# EAGLE design linearSensor (EAGLE 7.3.0)
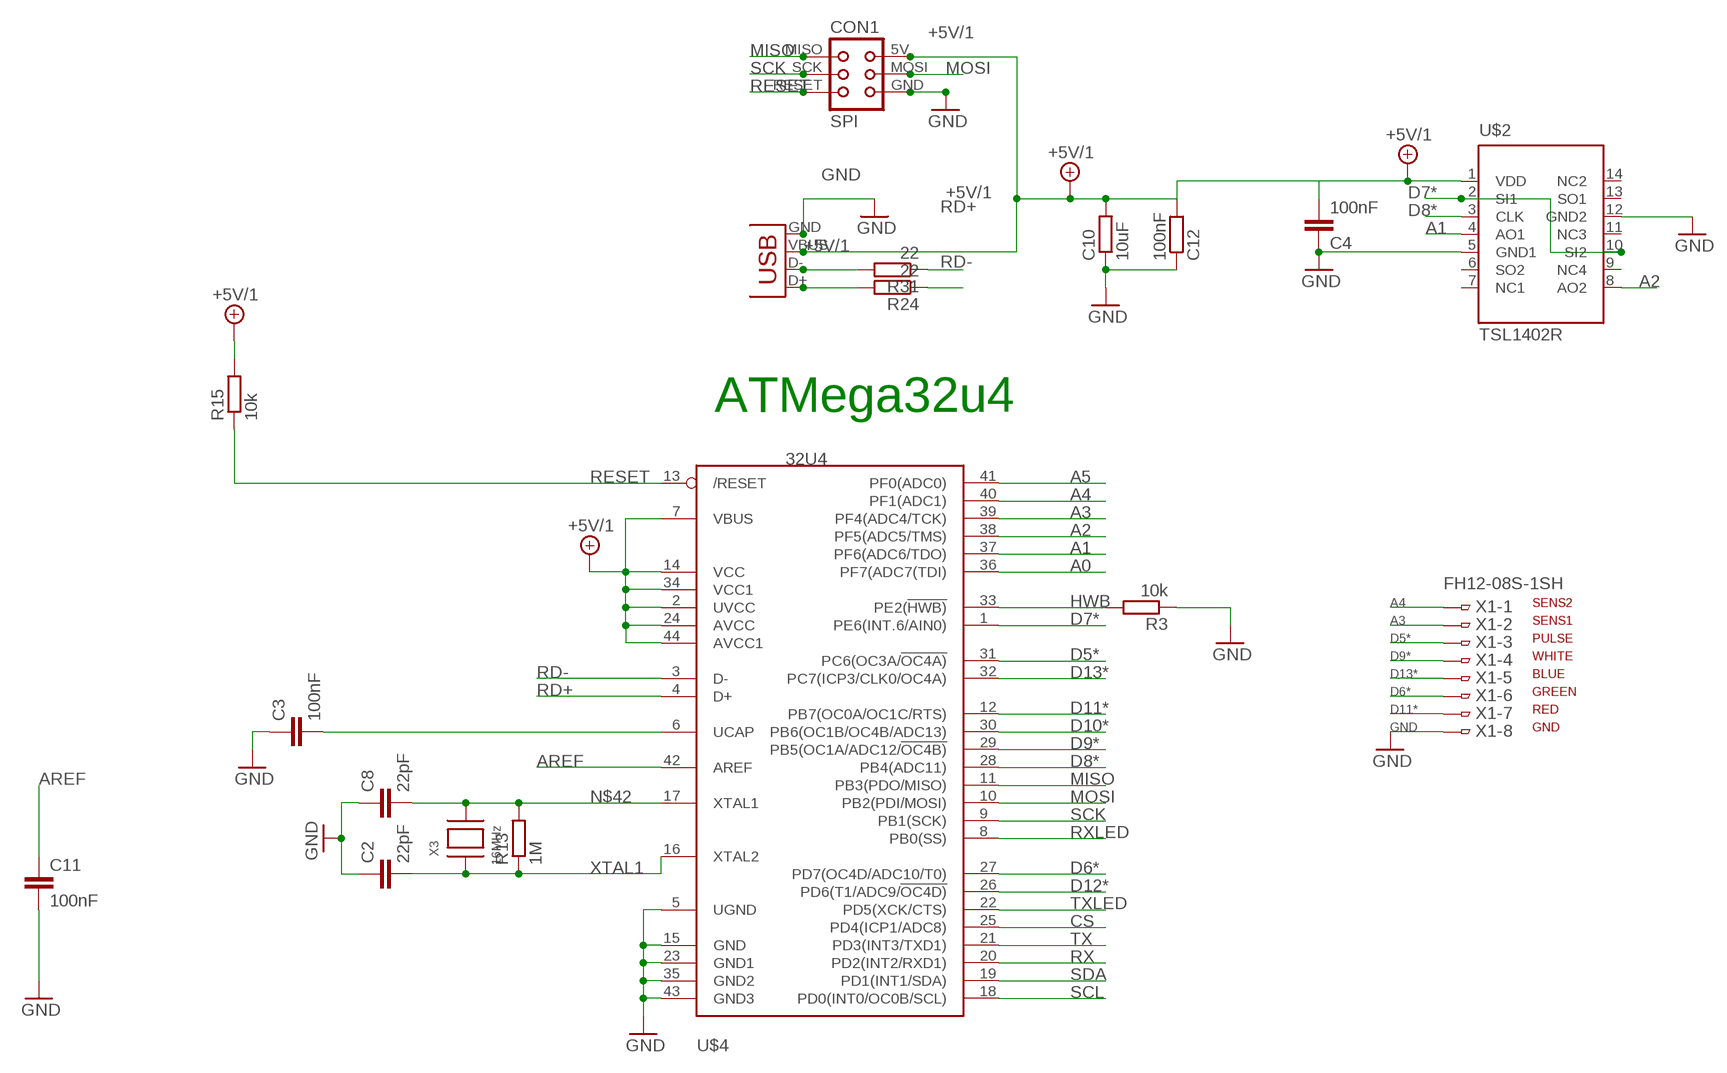
[diagram p0: schematic, sheet 1]

## Parts
C2  22pF  C-EUC0805K  [C0805K]
C3  100nF  C-EUC0805K  [C0805K]
C4  100nF  C-EUC0805  [C0805]
C8  22pF  C-EUC0805K  [C0805K]
C10  10uF  R-EU_M0805  [M0805]
C11  100nF  C-EUC0805K  [C0805K]
C12  100nF  R-EU_M0805  [M0805]
CON1  SPI  TINYISPT  [TC2030-MCP-NL]
R3  10k  R-EU_M0805  [M0805]
R13  1M  R-EU_M0805  [M0805]
R15  10k  R-EU_M0805  [M0805]
R24  22  R-EU_M0805  [M0805]
R31  22  R-EU_M0805  [M0805]
U$2  TSL1402R  [DIL14]
U$4  32U4  ATMEGA32U4-AU  [TQFP44]
X1  FH12-08S-1SH  [FH12-08S-1SH]
X2  USB-MICROB  [USB-MICROB]
X3  16MHz  XTALNX6035  [NX6035]

## Nets
+5V/1 [fine]: C4.2 C10.2 C12.2 CON1.5V(VCC) R15.2 U$2.1(VDD) U$4.2(UVCC) U$4.7(VBUS) U$4.14(VCC) U$4.24(AVCC) U$4.34(VCC1) U$4.44(AVCC1) X2.VBUS
A0: U$4.36(PF7(ADC7(TDI))
A1: U$2.4(AO1) U$4.37(PF6(ADC6/TDO))
A2: U$2.8(AO2) U$4.38(PF5(ADC5/TMS))
A3: U$4.39(PF4(ADC4/TCK)) X1.2
A4: U$4.40(PF1(ADC1)) X1.1
A5: U$4.41(PF0(ADC0))
AREF: C11.1 U$4.42(AREF)
CS: U$4.25(PD4(ICP1/ADC8))
D5*: U$4.31(PC6(OC3A/!OC4A)) X1.3
D6*: U$4.27(PD7(OC4D/ADC10/T0)) X1.6
D7*: U$2.2(SI1) U$2.10(SI2) U$4.1(PE6(INT.6/AIN0))
D8*: U$2.3(CLK) U$4.28(PB4(ADC11))
D9*: U$4.29(PB5(OC1A/ADC12/!OC4B)) X1.4
D10*: U$4.30(PB6(OC1B/OC4B/ADC13))
D11*: U$4.12(PB7(OC0A/OC1C/RTS)) X1.7
D12*: U$4.26(PD6(T1/ADC9/!OC4D))
D13*: U$4.32(PC7(ICP3/CLK0/OC4A)) X1.5
D_USB+ [USBA]: R24.2 X2.D+
D_USB- [USBA]: R31.2 X2.D-
GND [power]: C2.1 C3.1 C4.1 C8.1 C10.1 C11.2 C12.1 CON1.GND R3.1 U$2.5(GND1) U$2.12(GND2) U$4.5(UGND) U$4.15(GND) U$4.23(GND1) U$4.35(GND2) U$4.43(GND3) X1.8 X2.GND
HWB: R3.2 U$4.33(PE2(!HWB))
MISO: CON1.MISO U$4.11(PB3(PDO/MISO))
MOSI: CON1.MOSI U$4.10(PB2(PDI/MOSI))
N$16: C3.2 U$4.6(UCAP)
N$42: C8.2 R13.2 U$4.17(XTAL1) X3.P$2
RD+ [USBB]: R24.1 U$4.4(D+)
RD- [USBB]: R31.1 U$4.3(D-)
RESET: CON1.RESET R15.1 U$4.13(/RESET)
RX: U$4.20(PD2(INT2/RXD1))
RXLED: U$4.8(PB0(SS))
SCK: CON1.SCK U$4.9(PB1(SCK))
SCL: U$4.18(PD0(INT0/OC0B/SCL))
SDA: U$4.19(PD1(INT1/SDA))
TX: U$4.21(PD3(INT3/TXD1))
TXLED: U$4.22(PD5(XCK/CTS))
XTAL1: C2.2 R13.1 U$4.16(XTAL2) X3.P$1
Unconnected: U$2.6(SO2) U$2.7(NC1) U$2.9(NC4) U$2.11(NC3) U$2.13(SO1) U$2.14(NC2)

## Notes on the sheet
- ATMega32u4
- SENS2
- SENS1
- PULSE
- WHITE
- BLUE
- GREEN
- RED
- GND

## Library data of the parts
C2-C4 C8 C11 = rcl:C-EU: CAPACITOR, European symbol
C10 C12 R13 R24 R31 = rcl:R-EU_: RESISTOR, European symbol
CON1 = lpatiny:TINYISP: CONNECTOR
R3 R15 = resistor:R-EU_: RESISTOR, European symbol
U$2 = lpatiny:TSL1402R
U$4 = adafruit:ATMEGA32U4: http://www.ladyada.net/library/eagle
X1 = con-hirose:FH12-08S-1S: 1mm Pitch Connectors For FPC/FFC Source: Data sheet <http://www.hirose.co.jp/cataloge_hp/e58605370.pdf>; OC_FARNELL: unknown; OC_NEWARK: unknown
X2 = SparkFun:USB: USB Connectors USB-B-PTH is fully proven SKU : PRT-00139 USB-miniB is fully proven SKU : PRT-00587 USB-A-PCB is untested. USB-A-H is throughly reviewed, but untested. Spark Fun Electronics SKU : PRT-00437 USB-B-SMT is throughly reviewed, but untested. Needs silkscreen touching up. USB-A-S has not been used/tested USB-MB-H has not been used/tested
X3 = lpatiny:XTAL: Low cost SMT crystals, no capacitors included http://www.ladyada.net/library/eagle

## Net classes
0 default: width 0.254 mm
1 power: width 0.254 mm
2 VIN: width 0.254 mm
3 fine: width 0.254 mm
4 aref: width 0.254 mm
5 USBA: width 0.254 mm, clearance 0.254 mm
6 USBB: width 0.254 mm, clearance 0.254 mm

## Board
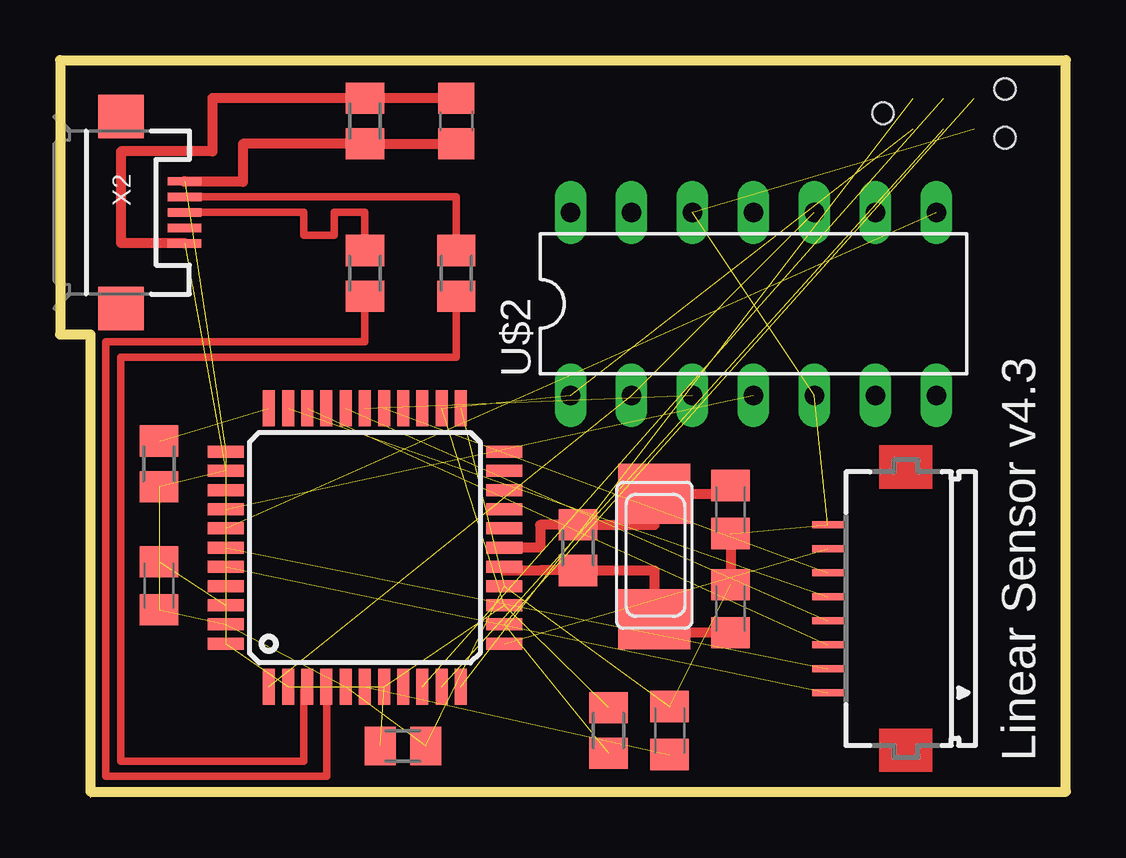
[diagram p1: board, top side]
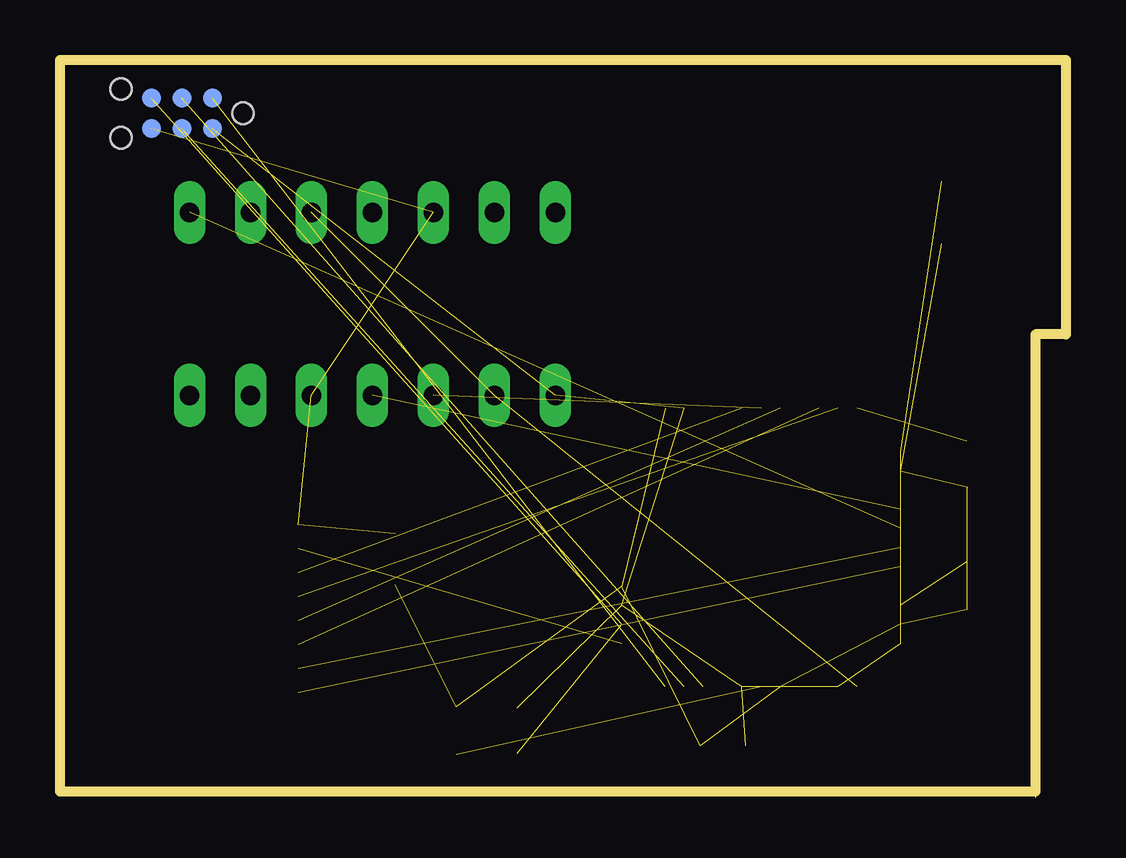
[diagram p2: board, bottom side, seen from below]

Size 41.91 x 30.73 mm. Coordinates in mm from the lower left corner, seen from the top.
Outline: 1.27,0.25 1.27,0
Outline: 1.27,0.25 41.91,0.25 41.91,30.73 0,30.73 0,19.3 1.27,19.3 1.27,0.25
Copper layers (1*16): Top 0.035mm / dielectric 1.5mm / Bottom 0.035mm
Design rules "Fusion_eagle_rule_v1.1": minimum track width 6mil, minimum drill 12mil, track to track 6mil, track to pad 6mil, pad to pad 6mil, via to via 6mil, smd to smd 0mil, copper to edge 10mil, drill to drill 10mil, minimum pad ring 10mil, minimum via ring 6mil, stop-mask expansion 2mil, vias tented up to drill 100mil, thermal gap 10mil
vRestrict: area 5.1,2.8 to 20.3,6.6; area 5.1,2.8 to 8.9,16.8; area 16.5,5.3 to 20.3,18; area 5.1,14.2 to 20.3,18; area 33,26.9 to 40.6,30.7

### Footprints (pad centres in the part's own frame; a part is rotated, then mirrored left to right if it is on the bottom)
C0805K = smd 1.3 x 1.6: 1 -1,0; 2 1,0
C0805 = smd 1.3 x 1.5: 1 -0.95,0; 2 0.95,0
M0805 = smd 1.3 x 1.6: 1 -0.95,0; 2 0.95,0
TC2030-MCP-NL = smd 0.787 x 0.787: 5V 1.27,0.635; GND 3.81,0.635; MISO 1.27,-0.635; MOSI 2.54,0.635; RESET 3.81,-0.635; SCK 2.54,-0.635 | hole 0.889: 0,0; 5.08,-1.016; 5.08,1.016
DIL14 = drill 0.813 long: 1 -7.62,-3.81; 2 -5.08,-3.81; 3 -2.54,-3.81; 4 0,-3.81; 5 2.54,-3.81; 6 5.08,-3.81; 7 7.62,-3.81; 8 7.62,3.81; 9 5.08,3.81; 10 2.54,3.81; 11 0,3.81; 12 -2.54,3.81; 13 -5.08,3.81; 14 -7.62,3.81
TQFP44 = smd 1.5 x 0.5: 1 -5.8,4; 2 -5.8,3.2; 3 -5.8,2.4; 4 -5.8,1.6; 5 -5.8,0.8; 6 -5.8,0; 7 -5.8,-0.8; 8 -5.8,-1.6; 9 -5.8,-2.4; 10 -5.8,-3.2; 11 -5.8,-4; 23 5.8,-4; 24 5.8,-3.2; 25 5.8,-2.4; 26 5.8,-1.6; 27 5.8,-0.8; 28 5.8,0; 29 5.8,0.8; 30 5.8,1.6; 31 5.8,2.4; 32 5.8,3.2; 33 5.8,4 | smd 0.5 x 1.5: 12 -4,-5.8; 13 -3.2,-5.8; 14 -2.4,-5.8; 15 -1.6,-5.8; 16 -0.8,-5.8; 17 0,-5.8; 18 0.8,-5.8; 19 1.6,-5.8; 20 2.4,-5.8; 21 3.2,-5.8; 22 4,-5.8; 34 4,5.8; 35 3.2,5.8; 36 2.4,5.8; 37 1.6,5.8; 38 0.8,5.8; 39 0,5.8; 40 -0.8,5.8; 41 -1.6,5.8; 42 -2.4,5.8; 43 -3.2,5.8; 44 -4,5.8
FH12-08S-1SH = smd 0.3 x 1.3: 1 -3.5,3.25; 2 -2.5,3.25; 3 -1.5,3.25; 4 -0.5,3.25; 5 0.5,3.25; 6 1.5,3.25; 7 2.5,3.25; 8 3.5,3.25
USB-MICROB = smd 0.35 x 1.4: D+ 0,2.65; D- -0.65,2.65; GND 1.3,2.65; ID 0.65,2.65; VBUS -1.3,2.65 | smd 1.8 x 1.9: MT1 -4,0; MT2 4,0
NX6035 = smd 2.5 x 3: P$1 2.665,0; P$2 -2.565,0

### Placement (x,y rotation side)
C2  27.94,7.87 270 top
C3  25.4,2.79 270 top
C4  16.51,28.19 270 top
C8  27.94,12 90 top
C10  12.7,28.19 270 top
C11  4.13,8.83 270 top
C12  14.29,2.16 180 top
CON1  34.29,28.51 180 bottom
R3  4.13,13.91 90 top
R13  21.59,10.41 90 top
R15  22.86,2.79 90 top
R24  12.7,21.84 90 top
R31  16.51,21.84 90 top
U$2  28.89,20.57 0 top
U$4  12.7,10.41 90 top
X1  35.24,7.87 90 top
X2  2.54,24.38 270 top
X3  24.77,10.1 270 top

### Tracks (layer width: path | path; a pad name or v marks a point on that pad's centre or on a via)
+5V/1  (10 unrouted)
  Top 0.406: X2.VBUS 5.19,25.65 7.62,25.65 7.62,27.24 C10.2 C4.2
A1  (1 unrouted)
A2  (1 unrouted)
A3  (1 unrouted)
A4  (1 unrouted)
AREF  (1 unrouted)
D5*  (1 unrouted)
D6*  (1 unrouted)
D7*  (2 unrouted)
D8*  (1 unrouted)
D9*  (1 unrouted)
D11*  (1 unrouted)
D13*  (1 unrouted)
D_USB+
  Top 0.305: R24.2 12.7,24.38 11.43,24.38 11.43,23.43 10.16,23.43 10.16,24.38 X2.D+
D_USB-
  Top 0.305: X2.D- 16.51,25.03 R31.2
GND  (14 unrouted)
  Top 0.406: C8.1 C2.1 | C4.1 C10.1 6.35,29.14 6.35,26.92 2.54,26.92 2.54,23.11 5.19,23.11 X2.GND
HWB  (1 unrouted)
MISO  (1 unrouted)
MOSI  (1 unrouted)
N$16  (1 unrouted)
N$42
  Top 0.406: U$4.17 20,10.41 20,11.36 R13.2 24.77,11.36 X3.P$2 27.94,12.66 C8.2
RD+
  Top 0.305: R24.1 12.7,18.99 1.91,18.99 1.91,0.89 11.11,0.89 11.11,4.6 U$4.4
RD-
  Top 0.305: U$4.3 10.16,4.47 10.16,1.52 2.54,1.52 2.54,18.35 16.51,18.35 R31.1
RESET  (2 unrouted)
SCK  (1 unrouted)
XTAL1
  Top 0.406: U$4.16 18.5,9.46 20,9.46 R13.1 24.77,9.46 X3.P$1 24.77,6.87 C2.2

### Text on the board
tPlace: Linear Sensor v4.3
203bmp: C:/Users/G/Pictures/logo_epfl.bmp